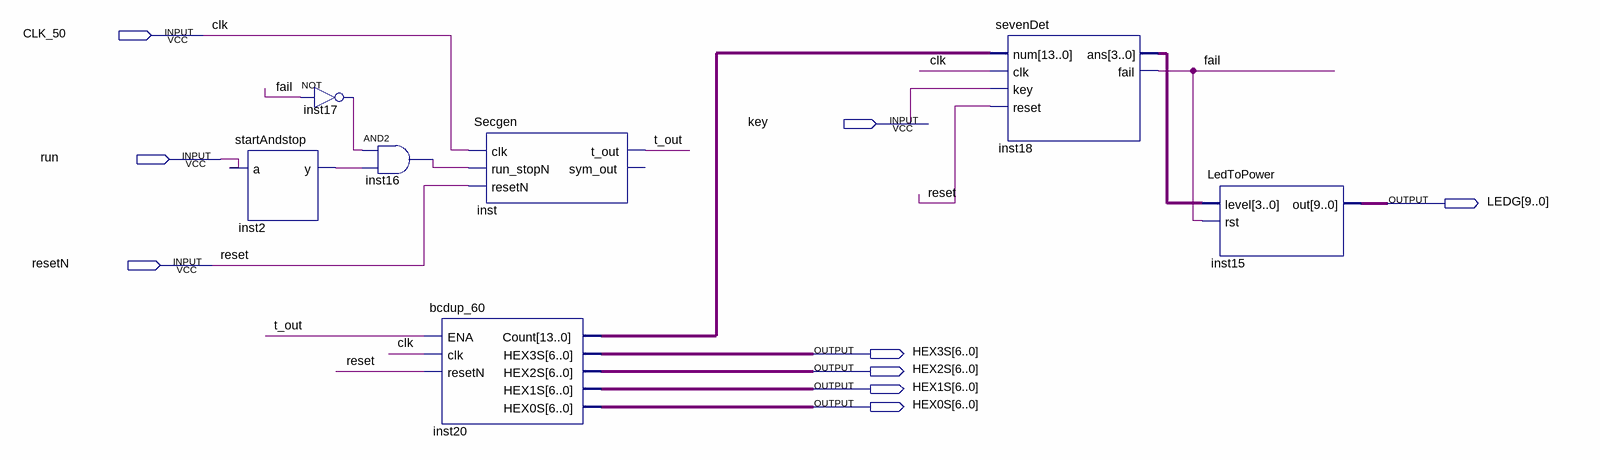
[diagram p0: schematic sheet]
// Quartus schematic Qfinal.bdf as structural Verilog: 7 symbols, 9 pins
module Qfinal (
  input  CLK_50,
  input  key,
  input  run,
  input  resetN,
  output [9:0] LEDG,
  output [6:0] HEX3S,
  output [6:0] HEX2S,
  output [6:0] HEX1S,
  output [6:0] HEX0S
);

  wire fail, inst2_y, inst16_out, inst17_out, t_out;
  wire [3:0] inst18_ans;
  wire [13:0] inst20_count;

  startAndstop inst2 (.a(run), .y(inst2_y));
  not inst17 (inst17_out, fail);
  and inst16 (inst16_out, inst17_out, inst2_y);
  Secgen inst (.clk(CLK_50), .run_stopN(inst16_out), .resetN(resetN), .t_out(t_out));  // open: sym_out
  bcdup_60 inst20 (
    .ENA(t_out), .clk(CLK_50), .resetN(resetN), .Count(inst20_count), .HEX3S(HEX3S), .HEX2S(HEX2S),
    .HEX1S(HEX1S), .HEX0S(HEX0S));
  sevenDet inst18 (.num(inst20_count), .clk(CLK_50), .key(key), .reset(resetN), .ans(inst18_ans), .fail(fail));
  LedToPower inst15 (.level(inst18_ans), .rst(fail), .out(LEDG));

  // Other names for the same wires on the sheet: clk = CLK_50; reset = resetN
endmodule
